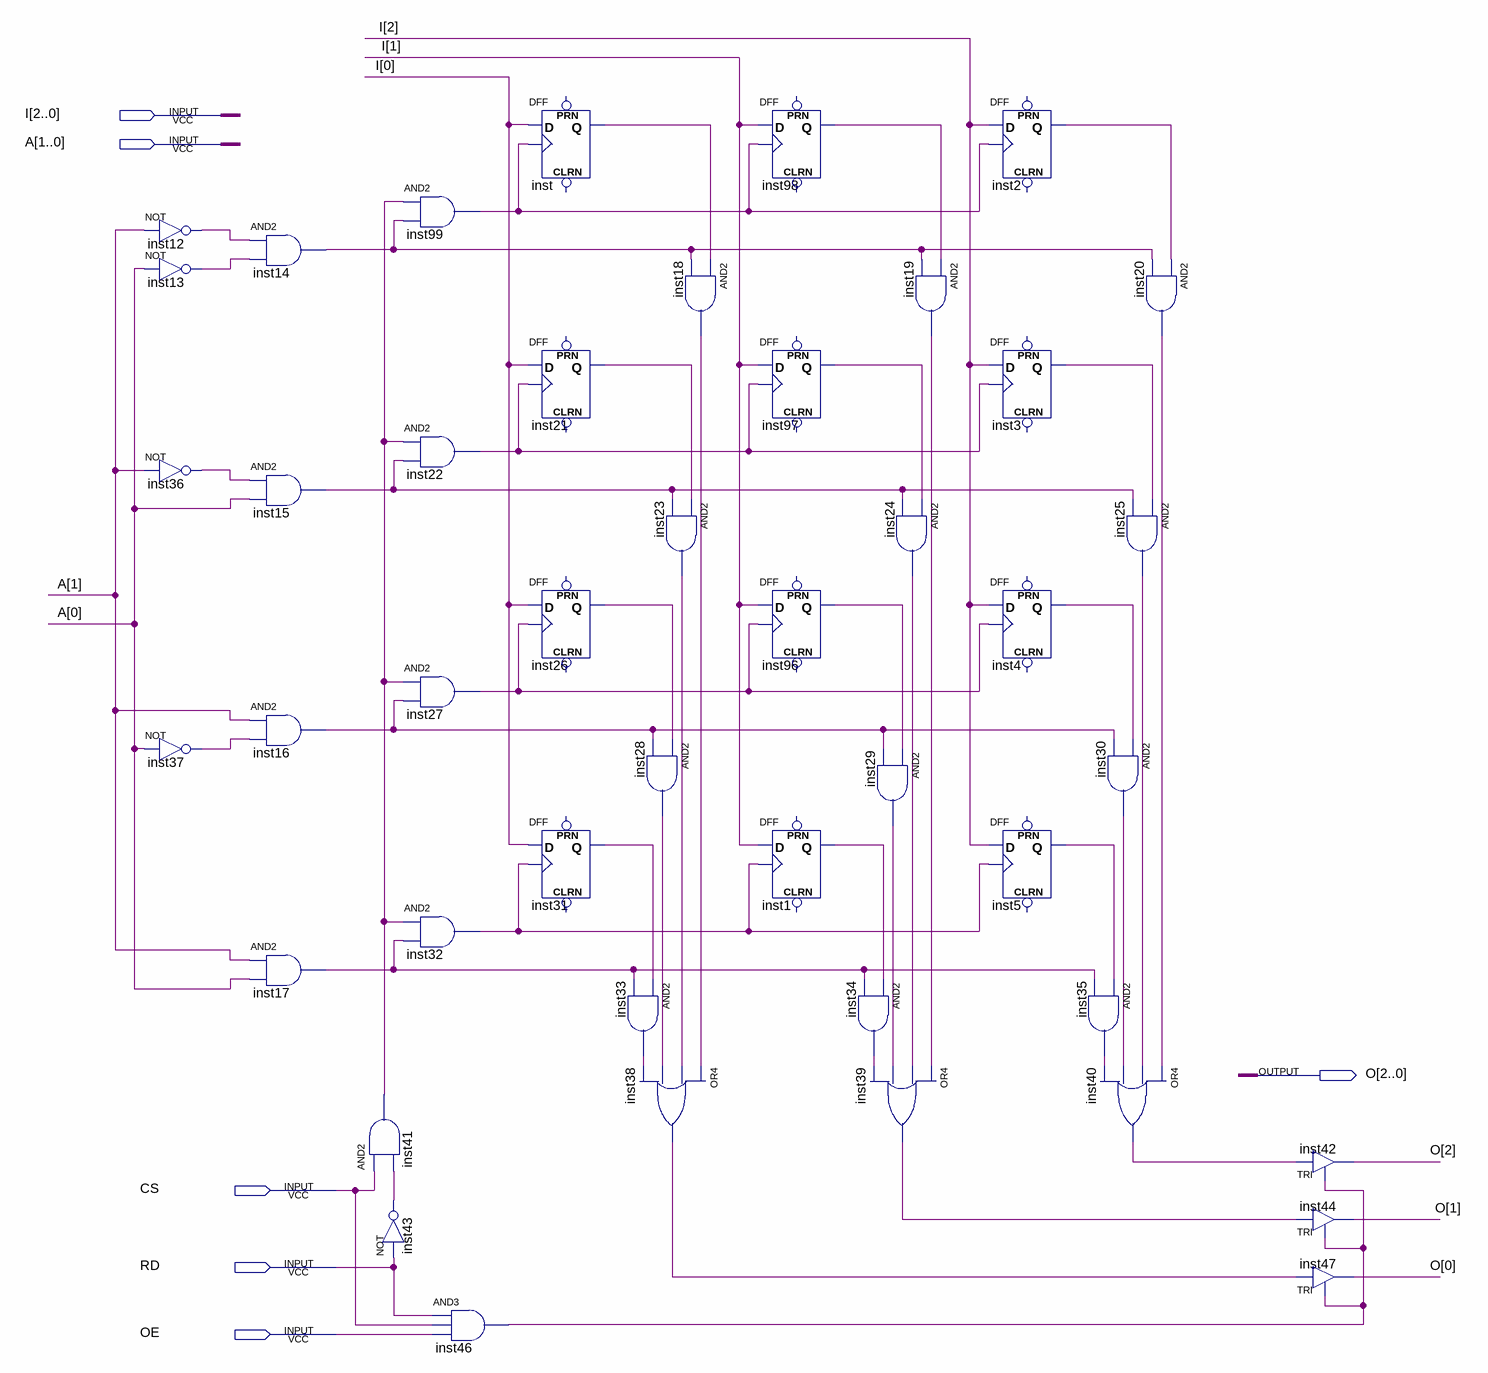
[diagram p0: schematic sheet]
// Quartus schematic MEM_4x3.bdf as structural Verilog: 45 symbols, 6 pins
module MEM_4x3 (
  input  [2:0] I,
  input  [1:0] A,
  input  CS,
  input  RD,
  input  OE,
  output [2:0] O
);

  wire inst1_q, inst2_q, inst3_q, inst4_q, inst5_q, inst12_out, inst13_out, inst14_out, inst15_out,
       inst16_out, inst17_out, inst18_out, inst19_out, inst20_out, inst21_q, inst22_out, inst23_out,
       inst24_out, inst25_out, inst26_q, inst27_out, inst28_out, inst29_out, inst30_out, inst31_q,
       inst32_out, inst33_out, inst34_out, inst35_out, inst36_out, inst37_out, inst38_out, inst39_out,
       inst40_out, inst41_out, inst43_out, inst46_out, inst96_q, inst97_q, inst98_q, inst99_out, inst_q;

  not inst12 (inst12_out, A[1]);
  not inst13 (inst13_out, A[0]);
  not inst36 (inst36_out, A[1]);
  not inst37 (inst37_out, A[0]);
  and inst14 (inst14_out, inst12_out, inst13_out);
  and inst15 (inst15_out, inst36_out, A[0]);
  and inst16 (inst16_out, A[1], inst37_out);
  and inst17 (inst17_out, A[1], A[0]);
  and inst41 (inst41_out, CS, inst43_out);
  and inst99 (inst99_out, inst41_out, inst14_out);
  and inst22 (inst22_out, inst41_out, inst15_out);
  and inst27 (inst27_out, inst41_out, inst16_out);
  and inst32 (inst32_out, inst41_out, inst17_out);
  not inst43 (inst43_out, RD);
  and inst46 (inst46_out, RD, CS, OE);
  DFF inst (.CLK(inst99_out), .D(I[0]), .Q(inst_q));  // open: CLRN, PRN
  DFF inst21 (.CLK(inst22_out), .D(I[0]), .Q(inst21_q));  // open: CLRN, PRN
  DFF inst26 (.CLK(inst27_out), .D(I[0]), .Q(inst26_q));  // open: CLRN, PRN
  DFF inst31 (.CLK(inst32_out), .D(I[0]), .Q(inst31_q));  // open: CLRN, PRN
  and inst23 (inst23_out, inst21_q, inst15_out);
  and inst28 (inst28_out, inst26_q, inst16_out);
  and inst33 (inst33_out, inst31_q, inst17_out);
  or inst38 (inst38_out, inst18_out, inst23_out, inst28_out, inst33_out);
  and inst18 (inst18_out, inst_q, inst14_out);
  DFF inst98 (.CLK(inst99_out), .D(I[1]), .Q(inst98_q));  // open: CLRN, PRN
  DFF inst97 (.CLK(inst22_out), .D(I[1]), .Q(inst97_q));  // open: CLRN, PRN
  DFF inst96 (.CLK(inst27_out), .D(I[1]), .Q(inst96_q));  // open: CLRN, PRN
  DFF inst1 (.CLK(inst32_out), .D(I[1]), .Q(inst1_q));  // open: CLRN, PRN
  and inst24 (inst24_out, inst97_q, inst15_out);
  and inst29 (inst29_out, inst96_q, inst16_out);
  and inst34 (inst34_out, inst1_q, inst17_out);
  or inst39 (inst39_out, inst19_out, inst24_out, inst29_out, inst34_out);
  and inst19 (inst19_out, inst98_q, inst14_out);
  DFF inst2 (.CLK(inst99_out), .D(I[2]), .Q(inst2_q));  // open: CLRN, PRN
  DFF inst3 (.CLK(inst22_out), .D(I[2]), .Q(inst3_q));  // open: CLRN, PRN
  DFF inst4 (.CLK(inst27_out), .D(I[2]), .Q(inst4_q));  // open: CLRN, PRN
  DFF inst5 (.CLK(inst32_out), .D(I[2]), .Q(inst5_q));  // open: CLRN, PRN
  and inst25 (inst25_out, inst3_q, inst15_out);
  and inst30 (inst30_out, inst4_q, inst16_out);
  and inst35 (inst35_out, inst5_q, inst17_out);
  or inst40 (inst40_out, inst20_out, inst25_out, inst30_out, inst35_out);
  and inst20 (inst20_out, inst2_q, inst14_out);
  TRI inst42 (.IN(inst40_out), .OE(inst46_out), .OUT(O[2]));
  TRI inst44 (.IN(inst39_out), .OE(inst46_out), .OUT(O[1]));
  TRI inst47 (.IN(inst38_out), .OE(inst46_out), .OUT(O[0]));
endmodule
